# EAGLE board OSSI-1 OBC (EAGLE 6.5.0)
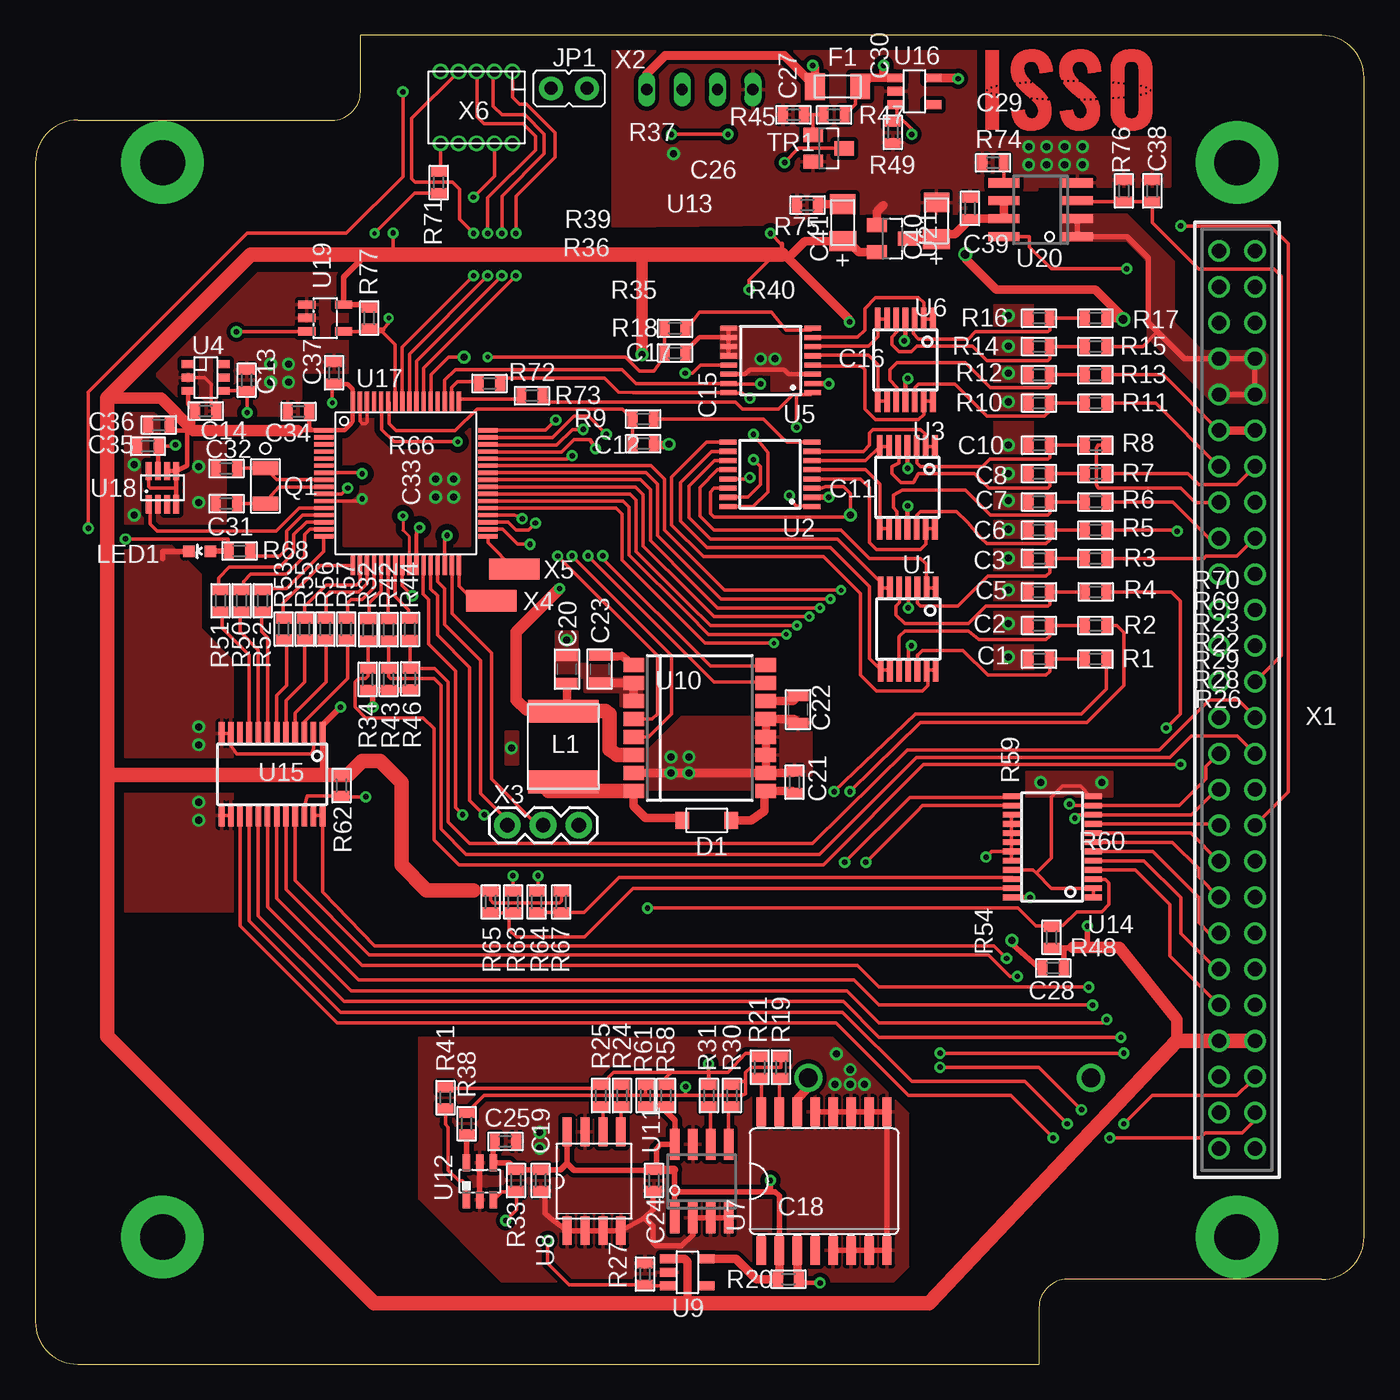
[diagram p4: board, top side]
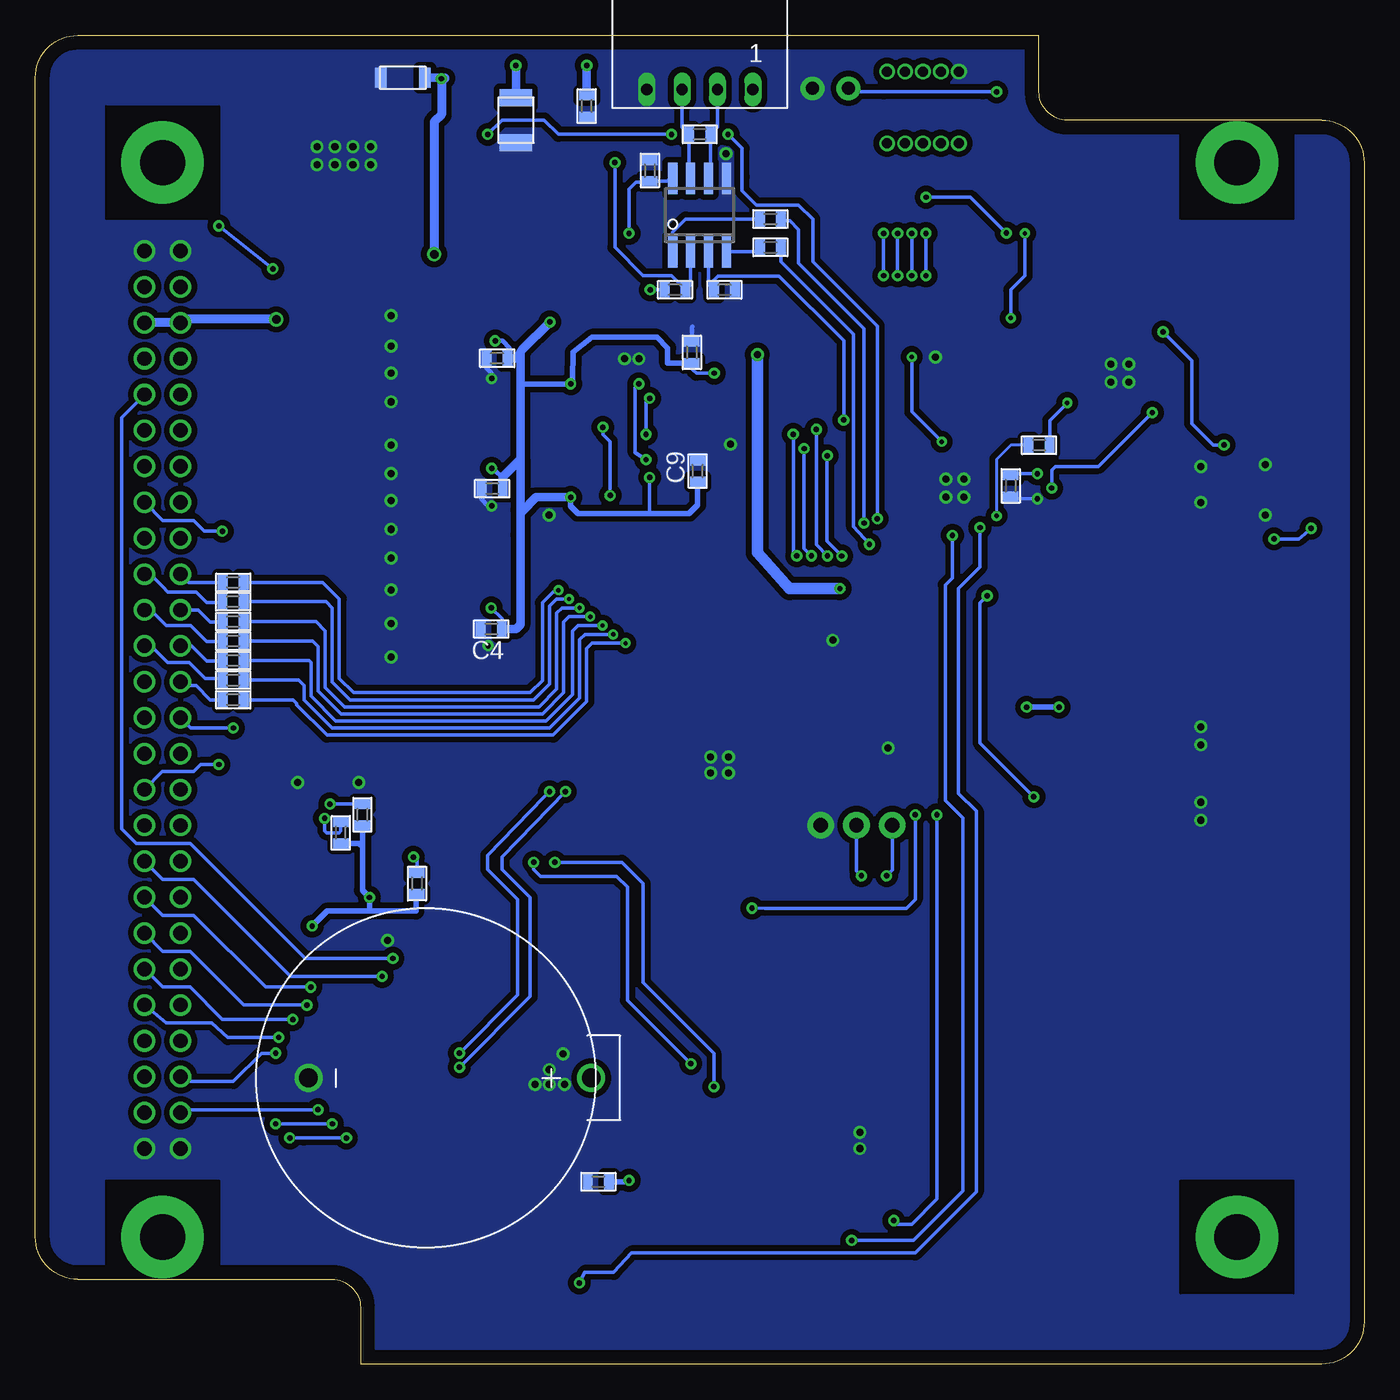
[diagram p5: board, bottom side, seen from below]

Size 94 x 94 mm. Coordinates in mm from the lower left corner, seen from the top.
Outline: 3,88 21,88 arc90 23,90 23,94 91,94 arc-90 94,91 94,9 arc-90 91,6 73,6 arc90 71,4 71,0 3,0 arc-90 0,3 0,85 arc-90 3,88
Copper layers (1*16): Top 0.035mm / dielectric 1.5mm / Bottom 0.035mm
Design rules "default": minimum track width 8mil, minimum drill 10mil, track to track 8mil, track to pad 8mil, pad to pad 4mil, via to via 8mil, smd to smd 2mil, copper to edge 40mil, drill to drill 8mil, minimum pad ring 8mil, minimum via ring 8mil, stop-mask expansion 4mil, vias tented up to drill 0mil, thermal gap 10mil

## Footprints (pad centres in the part's own frame; a part is rotated, then mirrored left to right if it is on the bottom)
BH32T-C-G = drill 1.32: N 0,8.3; P 0,-11.7
C0603(1608) = smd 0.7 x 1.1: 1 -0.75,0; 2 0.75,0
C0805(2012) = smd 0.7 x 1.5: 1 -0.95,0; 2 0.95,0
C1206-GCM31 = smd 0.8 x 1.4: P$1 -1.55,0; P$2 1.55,0
C1210-GCM32 = smd 1.2 x 2.3: P$1 -1.6,0; P$2 1.6,0
C1206(3216)-A = smd 1.4 x 1.9: 1 -1.3,0 | smd 1.4 x 1.8: 2 1.3,0
SOD-123 = smd 0.97 x 1.2: A -1.735,0; C 1.735,0
NANOSMDC150FCT = smd 1.4 x 1.9: 1 -1.6,0 | smd 1.4 x 1.8: 2 1.6,0
3.2-PAD-ROUND = drill 3.2 pad 5.842: B3,2 0,0
JP1 = drill 0.914 pad 1.676: 1 0,-1.27; 2 0,1.27
L(2220) = smd 1.6 x 5: P$1 -2.5,0; P$2 2.5,0
LED-0603 = smd 0.8 x 0.8: A 0,-0.75; C 0,0.75
NX-3215 = smd 1 x 1.8: 1 -1.25,0; 2 1.25,0
R0603(1608) = smd 0.7 x 1.1: 1 -0.75,0; 2 0.75,0
SOT23 = smd 1 x 1.4: 1 -0.95,-1.1; 2 0.95,-1.1; 3 0,1.1
TSSOP14-PW = smd 0.4 x 1.6: 1 -1.95,-2.9; 2 -1.3,-2.9; 3 -0.65,-2.9; 4 0,-2.9; 5 0.65,-2.9; 6 1.3,-2.9; 7 1.95,-2.9; 8 1.95,2.9; 9 1.3,2.9; 10 0.65,2.9; 11 0,2.9; 12 -0.65,2.9; 13 -1.3,2.9; 14 -1.95,2.9
TSSOP16-RU = smd 1.19 x 0.36: 1 -2.97,2.275; 2 -2.97,1.625; 3 -2.97,0.975; 4 -2.97,0.325; 5 -2.97,-0.325; 6 -2.97,-0.975; 7 -2.97,-1.625; 8 -2.97,-2.275; 9 2.97,-2.275; 10 2.97,-1.625; 11 2.97,-0.975; 12 2.97,-0.325; 13 2.97,0.325; 14 2.97,0.975; 15 2.97,1.625; 16 2.97,2.275
TSOT-6UJ-6 = smd 0.55 x 0.9: 1 -0.95,-1.25; 2 0,-1.25; 3 0.95,-1.25; 4 0.95,1.25; 5 0,1.25; 6 -0.95,1.25
SO16L = smd 0.66 x 2.032: 1 -4.445,-4.902; 2 -3.175,-4.902; 3 -1.905,-4.902; 4 -0.635,-4.902; 5 0.635,-4.902; 6 1.905,-4.902; 7 3.175,-4.902; 8 4.445,-4.902; 9 4.445,4.902; 10 3.175,4.902; 11 1.905,4.902; 12 0.635,4.902; 13 -0.635,4.902; 14 -1.905,4.902; 15 -3.175,4.902; 16 -4.445,4.902
SO08-208 = smd 0.66 x 2.032: 1 -1.905,-3.498; 2 -0.635,-3.498; 3 0.635,-3.498; 4 1.905,-3.498; 5 1.905,3.498; 6 0.635,3.498; 7 -0.635,3.498; 8 -1.905,3.498
TSOT23-5 = smd 0.62 x 1.22: P$1 -0.95,-1.31; P$2 0,-1.31; P$3 0.95,-1.31; P$4 0.95,1.31; P$5 -0.95,1.31
SOIC-16CAV = smd 1 x 1.43: 1 -4.445,-4.67; 2 -3.175,-4.67; 3 -1.905,-4.67; 4 -0.635,-4.67; 5 0.635,-4.67; 6 1.905,-4.67; 7 3.175,-4.67; 8 4.445,-4.67; 9 4.445,4.67; 10 3.175,4.67; 11 1.905,4.67; 12 0.635,4.67; 13 -0.635,4.67; 14 -1.905,4.67; 15 -3.175,4.67; 16 -4.445,4.67
SO8 = smd 0.65 x 2.2: 1 -1.905,-2.6; 2 -0.635,-2.6; 3 0.635,-2.6; 4 1.905,-2.6; 5 1.905,2.6; 6 0.635,2.6; 7 -0.635,2.6; 8 -1.905,2.6
SOT23-6DBV = smd 0.55 x 1.2: 1 -0.95,-1.3; 2 0,-1.3; 3 0.95,-1.3; 4 0.95,1.3; 5 0,1.3; 6 -0.95,1.3
TSSOP-24-PW = smd 0.4 x 1.2: 1 -3.575,-2.9; 2 -2.925,-2.9; 3 -2.275,-2.9; 4 -1.625,-2.9; 5 -0.975,-2.9; 6 -0.325,-2.9; 7 0.325,-2.9; 8 0.975,-2.9; 9 1.625,-2.9; 10 2.275,-2.9; 11 2.925,-2.9; 12 3.575,-2.9; 13 3.575,2.9; 14 2.925,2.9; 15 2.275,2.9; 16 1.625,2.9; 17 0.975,2.9; 18 0.325,2.9; 19 -0.325,2.9; 20 -0.975,2.9; 21 -1.625,2.9; 22 -2.275,2.9; 23 -2.925,2.9; 24 -3.575,2.9
PW_R-PDSO-G24 = smd 0.4 x 1.6: 1 -3.575,-2.9; 2 -2.925,-2.9; 3 -2.275,-2.9; 4 -1.625,-2.9; 5 -0.975,-2.9; 6 -0.325,-2.9; 7 0.325,-2.9; 8 0.975,-2.9; 9 1.625,-2.9; 10 2.275,-2.9; 11 2.925,-2.9; 12 3.575,-2.9; 13 3.575,2.9; 14 2.925,2.9; 15 2.275,2.9; 16 1.625,2.9; 17 0.975,2.9; 18 0.325,2.9; 19 -0.325,2.9; 20 -0.975,2.9; 21 -1.625,2.9; 22 -2.275,2.9; 23 -2.925,2.9; 24 -3.575,2.9
PM/PAG64 = smd 1.4 x 0.3: 1 -5.8,3.75; 2 -5.8,3.25; 3 -5.8,2.75; 4 -5.8,2.25; 5 -5.8,1.75; 6 -5.8,1.25; 7 -5.8,0.75; 8 -5.8,0.25; 9 -5.8,-0.25; 10 -5.8,-0.75; 11 -5.8,-1.25; 12 -5.8,-1.75; 13 -5.8,-2.25; 14 -5.8,-2.75; 15 -5.8,-3.25; 16 -5.8,-3.75; 33 5.8,-3.75; 34 5.8,-3.25; 35 5.8,-2.75; 36 5.8,-2.25; 37 5.8,-1.75; 38 5.8,-1.25; 39 5.8,-0.75; 40 5.8,-0.25; 41 5.8,0.25; 42 5.8,0.75; 43 5.8,1.25; 44 5.8,1.75; 45 5.8,2.25; 46 5.8,2.75; 47 5.8,3.25; 48 5.8,3.75 | smd 0.3 x 1.4: 17 -3.75,-5.8; 18 -3.25,-5.8; 19 -2.75,-5.8; 20 -2.25,-5.8; 21 -1.75,-5.8; 22 -1.25,-5.8; 23 -0.75,-5.8; 24 -0.25,-5.8; 25 0.25,-5.8; 26 0.75,-5.8; 27 1.25,-5.8; 28 1.75,-5.8; 29 2.25,-5.8; 30 2.75,-5.8; 31 3.25,-5.8; 32 3.75,-5.8; 49 3.75,5.8; 50 3.25,5.8; 51 2.75,5.8; 52 2.25,5.8; 53 1.75,5.8; 54 1.25,5.8; 55 0.75,5.8; 56 0.25,5.8; 57 -0.25,5.8; 58 -0.75,5.8; 59 -1.25,5.8; 60 -1.75,5.8; 61 -2.25,5.8; 62 -2.75,5.8; 63 -3.25,5.8; 64 -3.75,5.8
SOT23-8 = smd 0.42 x 1.3: 1 -0.975,-1.175; 2 -0.325,-1.175; 3 0.325,-1.175; 4 0.975,-1.175; 5 0.975,1.175; 6 0.325,1.175; 7 -0.325,1.175; 8 -0.975,1.175
SOT23-5DBV = smd 0.6 x 1.22: 1 -0.95,-1.3; 2 0,-1.3; 3 0.95,-1.3; 4 0.95,1.3; 5 -0.95,1.3
ESQ-126-XX-X-D = drill 1.016 pad 1.524: 1 -1.27,31.75; 2 1.27,31.75; 3 -1.27,29.21; 4 1.27,29.21; 5 -1.27,26.67; 6 1.27,26.67; 7 -1.27,24.13; 8 1.27,24.13; 9 -1.27,21.59; 10 1.27,21.59; 11 -1.27,19.05; 12 1.27,19.05; 13 -1.27,16.51; 14 1.27,16.51; 15 -1.27,13.97; 16 1.27,13.97; 17 -1.27,11.43; 18 1.27,11.43; 19 -1.27,8.89; 20 1.27,8.89; 21 -1.27,6.35; 22 1.27,6.35; 23 -1.27,3.81; 24 1.27,3.81; 25 -1.27,1.27; 26 1.27,1.27; 27 -1.27,-1.27; 28 1.27,-1.27; 29 -1.27,-3.81; 30 1.27,-3.81; 31 -1.27,-6.35; 32 1.27,-6.35; 33 -1.27,-8.89; 34 1.27,-8.89; 35 -1.27,-11.43; 36 1.27,-11.43; 37 -1.27,-13.97; 38 1.27,-13.97; 39 -1.27,-16.51; 40 1.27,-16.51; 41 -1.27,-19.05; 42 1.27,-19.05; 43 -1.27,-21.59; 44 1.27,-21.59; 45 -1.27,-24.13; 46 1.27,-24.13; 47 -1.27,-26.67; 48 1.27,-26.67; 49 -1.27,-29.21; 50 1.27,-29.21; 51 -1.27,-31.75; 52 1.27,-31.75
22-05-7045 = drill 0.8 long: 1 -3.75,0; 2 -1.25,0; 3 1.25,0; 4 3.75,0
1X03 = drill 1.016 pad 1.88: 1 0,0; 2 2.54,0; 3 5.08,0
P-PAD-S = smd 3.556 x 1.5: 1 0,0
M50-3200545 = drill 0.7 pad 1: 1 -2.54,-2.54; 2 -2.54,2.54; 3 -1.27,-2.54; 4 -1.27,2.54; 5 0,-2.54; 6 0,2.54; 7 1.27,-2.54; 8 1.27,2.54; 9 2.54,-2.54; 10 2.54,2.54

## Placement (x,y rotation side)
BAT1  BATTERY-BH32T  [BH32T-C-G]  66.38,20.25 90 bottom
C1  100nF  [C0603(1608)]  71,49.88 180 top
C2  100nF  [C0603(1608)]  71,52.25 180 top
C3  100nF  [C0603(1608)]  71,57 180 top
C4  100nF  [C0603(1608)]  61.75,52 180 bottom
C5  100nF  [C0603(1608)]  71,54.62 180 top
C6  100nF  [C0603(1608)]  71,59 180 top
C7  100nF  [C0603(1608)]  71,61 180 top
C8  100nF  [C0603(1608)]  71,63 180 top
C9  100nF  [C0603(1608)]  47.16,63.18 90 bottom
C10  100nF  [C0603(1608)]  71,65 180 top
C11  100nF  [C0603(1608)]  61.68,61.94 180 bottom
C12  100nF  [C0603(1608)]  43,65.11 0 top
C13  100nF  [C0603(1608)]  14.95,69.6 270 top
C14  100nF  [C0603(1608)]  12.05,67.43 180 top
C15  100nF  [C0603(1608)]  47.55,71.57 90 bottom
C16  100nF  [C0603(1608)]  61.33,71.16 180 bottom
C17  100nF  [C0603(1608)]  45.25,71.52 0 top
C18  100nF  [C0603(1608)]  54.17,12.9 180 bottom
C19  100nF  [C0603(1608)]  35.75,13 270 top
C20  1uF 0805  [C0805(2012)]  37.6,49.15 90 top
C21  100nF  [C0603(1608)]  53.7,41.18 270 top
C22  1uF 0805  [C0805(2012)]  53.95,46.3 270 top
C23  1uF 0805  [C0805(2012)]  39.92,49.18 270 top
C24  100nF  [C0603(1608)]  43.75,13 270 top
C25  100nF  [C0603(1608)]  33.26,15.75 0 top
C26  100nF  [C0603(1608)]  50.52,84.43 90 bottom
C27  100nF  [C0603(1608)]  55,89 270 bottom
C28  100nF  [C0603(1608)]  72,28.02 180 top
C29  4.7uF, 1210  [C1206-GCM31]  68,91 180 bottom
C30  10uF,3225  [C1210-GCM32]  60,88 270 bottom
C31  12.5pF  [C0603(1608)]  13.52,60.87 180 top
C32  12.5pF  [C0603(1608)]  13.52,63.37 180 top
C33  100nF  [C0603(1608)]  25,62.13 270 bottom
C34  100nF  [C0603(1608)]  18.61,67.39 180 top
C35  100nF  [C0603(1608)]  7.96,64.94 180 top
C36  100nF  [C0603(1608)]  8.73,66.43 180 top
C37  100nF  [C0603(1608)]  21.13,70.13 90 top
C38  1uF  [C0603(1608)]  79,83 90 top
C39  100nF  [C0603(1608)]  66.12,81.76 90 top
C40  10uF, LDO Tantal 16V  [C1206(3216)-A]  63.75,80.88 90 top
C41  10uF, LDO Tantal 16V  [C1206(3216)-A]  57.12,80.75 90 top
D1  MMSD4148T1G  [SOD-123]  47.5,38.46 0 top
F1  POLYSWITCH  [NANOSMDC150FCT]  56.75,90.38 0 top
H1  MOUNT-PAD-ROUND3.2  [3.2-PAD-ROUND]  85,85 0 top
H2  MOUNT-PAD-ROUND3.2  [3.2-PAD-ROUND]  85,9 0 top
H3  MOUNT-PAD-ROUND3.2  [3.2-PAD-ROUND]  9,9 0 top
H4  MOUNT-PAD-ROUND3.2  [3.2-PAD-ROUND]  9,85 0 top
JP1  [JP1]  37.75,90.25 90 top
L1  470uH, 240mA  [L(2220)]  37.35,43.69 270 top
LED1  [LED-0603]  11.62,57.5 90 top
Q1  NX-3215  [NX-3215]  16.27,62.13 270 top
R1  10k  [R0603(1608)]  75,49.88 0 top
R2  10k  [R0603(1608)]  75,52.25 0 top
R3  10k  [R0603(1608)]  75,57 0 top
R4  10k  [R0603(1608)]  75.01,54.63 0 top
R5  10k  [R0603(1608)]  75,59 0 top
R6  10k  [R0603(1608)]  75,61 0 top
R7  10k  [R0603(1608)]  75,63 0 top
R8  10k  [R0603(1608)]  75,65 0 top
R9  10k  [R0603(1608)]  43,66.86 0 top
R10  100k  [R0603(1608)]  71,67.98 0 top
R11  100k  [R0603(1608)]  75,67.98 0 top
R12  100k  [R0603(1608)]  71,69.98 0 top
R13  100k  [R0603(1608)]  75,69.98 0 top
R14  100k  [R0603(1608)]  71,71.98 0 top
R15  100k  [R0603(1608)]  75,71.98 0 top
R16  100k  [R0603(1608)]  71,73.98 0 top
R17  100k  [R0603(1608)]  75,73.98 0 top
R18  10k  [R0603(1608)]  45.25,73.27 0 top
R19  250  [R0603(1608)]  52.74,21 270 top
R20  470k  [R0603(1608)]  53.27,6.02 180 top
R21  250  [R0603(1608)]  51.24,21 270 top
R22  1.5k  [R0603(1608)]  80,51.14 0 bottom
R23  1.5k  [R0603(1608)]  80,52.52 0 bottom
R24  250  [R0603(1608)]  41.49,19 270 top
R25  250  [R0603(1608)]  40,19 270 top
R26  1.5k  [R0603(1608)]  80,47 0 bottom
R27  100k  [R0603(1608)]  43.12,6.38 90 top
R28  1.5k  [R0603(1608)]  80,48.38 0 bottom
R29  1.5k  [R0603(1608)]  80,49.76 0 bottom
R30  250  [R0603(1608)]  49.27,19 270 top
R31  250  [R0603(1608)]  47.65,19 270 top
R32  4.7k  [R0603(1608)]  23.54,51.96 90 top
R33  470k  [R0603(1608)]  34,13 270 top
R34  470k  [R0603(1608)]  23.51,48.45 270 top
R35  33k  [R0603(1608)]  45.25,76 180 bottom
R36  4.7k  [R0603(1608)]  42,79 180 bottom
R37  120, DNP  [R0603(1608)]  47,87 0 bottom
R38  250  [R0603(1608)]  30.51,17.01 270 top
R39  4.7k  [R0603(1608)]  42,81 180 bottom
R40  33k  [R0603(1608)]  48.75,76 180 bottom
R41  250  [R0603(1608)]  29.01,18.84 270 top
R42  4.7k  [R0603(1608)]  25,51.96 90 top
R43  470k  [R0603(1608)]  25,48.45 270 top
R44  4.7k  [R0603(1608)]  26.49,51.98 90 top
R45  100k  [R0603(1608)]  53.62,88.38 180 top
R46  470k  [R0603(1608)]  26.53,48.47 270 top
R47  100k  [R0603(1608)]  56.5,88.38 180 top
R48  100k  [R0603(1608)]  71.89,30.19 270 top
R49  100k  [R0603(1608)]  60.66,87.14 270 top
R50  1.5k  [R0603(1608)]  13.1,54 90 top
R51  1.5k  [R0603(1608)]  14.59,54 90 top
R52  1.5k  [R0603(1608)]  16.08,54 90 top
R53  1.5k  [R0603(1608)]  17.57,52 90 top
R54  10k  [R0603(1608)]  67,34 270 bottom
R55  1.5k  [R0603(1608)]  19.06,52 90 top
R56  1.5k  [R0603(1608)]  20.51,52 90 top
R57  1.5k  [R0603(1608)]  22,52 90 top
R58  10k  [R0603(1608)]  44.62,19 270 top
R59  10k  [R0603(1608)]  70.87,38.86 270 bottom
R60  10k  [R0603(1608)]  72.39,37.59 270 bottom
R61  10k  [R0603(1608)]  43.17,19 270 top
R62  100k  [R0603(1608)]  21.66,40.93 90 top
R63  250  [R0603(1608)]  33.8,32.7 90 top
R64  250  [R0603(1608)]  35.47,32.7 90 top
R65  10k  [R0603(1608)]  32.2,32.7 90 top
R66  300k  [R0603(1608)]  23,65 180 bottom
R67  10k  [R0603(1608)]  37.2,32.7 90 top
R68  4.7k  [R0603(1608)]  14.45,57.52 0 top
R69  4.7k  [R0603(1608)]  80.02,53.94 0 bottom
R70  4.7k  [R0603(1608)]  80,55.3 0 bottom
R71  4.7k  [R0603(1608)]  28.54,83.59 270 top
R72  0  [R0603(1608)]  32.12,69.38 0 top
R73  0  [R0603(1608)]  35.12,68.5 0 top
R74  6.2k  [R0603(1608)]  67.75,84.98 0 top
R75  0  [R0603(1608)]  54.62,82 180 top
R76  100k  [R0603(1608)]  77,83 270 top
R77  100k  [R0603(1608)]  23.62,74 90 top
TR1  FDV301N  [SOT23]  56.12,86 270 top
U1  OPA4347  [TSSOP14-PW]  61.75,52 180 top
U2  ADG708  [TSSOP16-RU]  51.96,62.95 180 top
U3  OPA4347  [TSSOP14-PW]  61.69,62.02 180 top
U4  ADR121  [TSOT-6UJ-6]  12.06,69.8 270 top
U5  ADG708  [TSSOP16-RU]  52.02,71 180 top
U6  OPA4347  [TSSOP14-PW]  61.55,71.04 180 top
U7  DS3231-L  [SO16L]  55.8,12.94 0 top
U8  24LC256-8LEAD  [SO08-208]  39.52,12.94 0 top
U9  LTC4411  [TSOT23-5]  46.12,6.5 270 top
U10  ADXRS450SOIC  [SOIC-16CAV]  47,45 270 top
U11  FM24V02-G  [SO8]  47.14,12.94 0 top
U12  TMP101  [SOT23-6DBV]  31.44,12.94 0 top
U13  SN65HVD11QD  [SO8]  47.01,81.28 0 bottom
U14  TCA9548APWR  [TSSOP-24-PW]  71.93,36.59 90 top
U15  SN74LVC8T245PWR  [PW_R-PDSO-G24]  16.75,41.72 180 top
U16  LTC4411  [TSOT23-5]  62.19,90.04 270 top
U17  MSP430F1611  [PM/PAG64]  26.21,62.31 0 top
U18  MAX6369  [SOT23-8]  9,62 0 top
U19  TPS3838  [SOT23-5DBV]  20.51,74 270 top
U20  MAX890L  [SO8]  71.12,81.66 90 top
U21  MCP1700_SOT23  [SOT23]  60.62,79.62 270 top
U$1  OSSILOGORECT  [OSSILOGORECT1005]  79,93 180 top
X1  ESQ-126-38-G-D  [ESQ-126-XX-X-D]  85,47 0 top
X2  MOLEX-22-05-7045  [22-05-7045]  47,90.17 180 bottom
X3  [1X03]  33.38,38.12 0 top
X4  P-PAD-S  [P-PAD-S]  32.25,54 180 top
X5  P-PAD-S  [P-PAD-S]  33.88,56.25 180 top
X6  JTAG10PINMINI-H  [M50-3200545]  31.21,88.9 180 top

## Tracks (layer width: path | path; a pad name or v marks a point on that pad's centre or on a via)
3.3VOBC  (via drill 0.31, 0.38, 0.5)
  Top 0.254: R65.2 32.2,32.82 32.38,32.64 37.08,32.64 37.21,32.77 37.21,33.44 R67.2 | U18.8 8.03,62.08 8.13,61.98 9.97,61.98 | X6.4 32.48,84.04 v30.99,82.55 | v25.31,80.02 25.31,78.61 27.43,78.49 | 27.69,78.49 23.38,78.49 | U5.13 47.05,70.67 46.48,70.1 v45.97,70.1 | U2.13 50.19,62.62 v50.55,62.72 | v21,68 21,69 21,69.25 C37.1 | 52.83,79.26 52.83,79.17 v52,80 | v50.5,76 50.5,76.67 52.83,79 | U1.4 v61.75,53.5
  Top 0.305: 19.56,66.06 U17.1 21.86,66.06 22.35,66.55 22.46,66.69 U17.64 22.46,68.98 22.1,69.34 21.16,69.34 C37.1 | 19.56,66.06 18.56,66.06 18.54,66.04 | C34.1 19.36,66.25 19.56,66.06 | 10.92,66.04 11.18,66.04 11.18,67.3 C14.2 10.81,67.92 U4.3 | 10.92,66.04 9.88,66.04 C36.1 | U18.5 10.74,63.57 10.74,65.86 10.92,66.04 | U18.5 U18.6 | U18.4 9.97,61.98 U18.5 | 52.83,79.26 52.83,79.17 52.83,79 52.83,78.74 52.83,78.49 | U6.4 61.55,72.72 v61.47,72.39 | U3.4 61.69,63.53 v61.72,63.37
  Top 0.406: X1.45 | R65.2 31.07,33.45 30.99,33.53 | 54.86,4.58 55.12,4.32 | R62.2 21.36,41.68 21.34,41.66 20.57,41.66 20.33,41.9 U15.1 20.33,45.22 v21.59,46.48 | v23.88,46.48 23.88,47.33 R34.2 R43.2 26.5,47.7 R46.2 | R48.2 72.9,29.44 | 72.9,29.44 73.38,29.44 73.41,29.46 | C28.1 72.75,29.3 72.9,29.44 | v74.42,30.99 74.42,29.46 | U14.24 v70.35,33.02 v70.36,33.02 | 23.38,78.49 21.81,76.91 U19.5 23.42,74.95 R77.2 | U5.2 56.1,69.38 v56.13,69.34 | U2.2 v56.13,61.32 v56.13,61.33
  Top 0.61: C20.1 37.6,46.25 37.08,46.26 38.28,46.26 L1.P$1 | 5.36,41.68 5.33,41.66 5.08,41.66 | v57.6,73.72 57.6,73.9 53.25,78.25 | 53.25,78.25 52.88,78.62 | 52.88,78.62 52.75,78.75 | 52.83,78.74 52.83,78.67 52.88,78.62 | 17.27,11 17.14,11.14 | U9.P$1 45.92,7.45 46.12,7.25 46.12,4.32 | 46.12,4.32 46.12,4.25 46.12,4.32 | 53.25,78.25 54.45,79.45 C41.1 57.48,79.45 58.26,78.67 U21.2
  Top 0.813: U10.6 | 80.76,22.86 80.76,24.38 76.68,29.46 74.42,29.46 73.41,29.46 | 5.08,68.33 8.89,68.33 11.18,66.04 18.54,66.04 | 37.6,46.25 37.85,46.25 35.05,46.26 34.74,46.26 34,47 34,51.78 v37.08,54.86 | v42.93,71.41 42.93,78.49
  Top 1.016: 52.83,78.49 42.93,78.49 27.69,78.49 27.43,78.49 23.38,78.49 15.24,78.49 5.08,68.33 5.08,41.66 5.08,23.19 17.14,11.14 23.96,4.32 46.12,4.32 55.12,4.32 63.21,4.32 80.76,22.86 X1.45 | X1.45 X1.46 | L1.P$1 40.33,46.19 40.63,46.01 40.63,43.47 41.14,43.09 U10.6 | 5.36,41.68 R62.2 22.12,41.68 23.11,42.67 24.38,42.67 25.91,41.15 25.91,35.31 27.69,33.53 30.99,33.53
  Bottom 0.254: v30.99,82.55 27.84,82.55 v25.31,80.02 | v45.97,70.1 47.24,70.1 47.5,70.36 47.5,70.87 C15.1 | v50.55,62.72 50.55,60.18 | R66.1 22.25,66.75 v21,68 | U13.8 48.91,83.92 49,84 49.32,83.68 C26.1 50.5,83.66 50.5,83.62 51.5,83.62 52,83.12 v52,80 | R40.2 v50.5,76 | v61.75,53.5 61,52.75 C4.1
  Bottom 0.305: v61.47,72.39 60.96,72.39 60.45,71.88 60.45,71.12 60.49,71.16 C16.1 | v61.72,63.37 60.96,62.74 59.69,64.01
  Bottom 0.406: v21.59,46.48 v23.88,46.48 | 70.36,32.04 67.08,32.04 67.08,33.17 R54.2 | 70.36,32.04 73.37,32.04 v74.42,30.99 | 70.36,32.04 70.36,32.3 v70.36,33.02 70.87,33.53 70.87,36.58 | R59.2 70.87,36.58 | R60.2 71.13,36.84 70.87,36.58 | 59.69,69.34 v56.13,69.34 56.1,69.38 56.01,69.63 55.95,71.59 54.61,72.64 50.04,72.64 49.28,71.88 49.28,70.82 C15.1 | 59.56,60.33 59.69,60.45 | v56.13,61.33 56.13,60.69 55.63,60.18 50.55,60.18 47.75,60.18 47.16,60.78 C9.1
  Bottom 0.61: C16.1 59.94,71.11 | 59.94,71.11 59.57,71.75 v57.6,73.72 | C11.1 60.93,62.77 59.69,64.01 | 59.69,64.01 59.69,69.34 59.69,71.5 59.94,71.11 | 59.69,64.01 59.69,60.45 59.69,58.67 59.69,52.31 60,52 C4.1 | 59.56,60.33 58.56,61.33 v56.13,61.33
  Bottom 0.813: v37.08,54.86 40.64,54.86 42.93,57.4 v42.93,71.41
3.3VOBC_I2C  (via drill 0.38)
  Top 0.203: 45.21,10.41 U11.1 | C24.1 43.81,13.84 43.72,13.72 | R33.1 34.04,13.84 34.04,13.75
  Top 0.406: C25.1 32.39,15.63 U12.4 33.51,14.24 R33.1 34.04,13.75 C19.1 37.16,13.75 37.62,14.2 | C24.1 43.94,13.94 43.94,15.24 44.24,15.54 U11.8 45.25,15.55 45.25,17.25 44.62,17.88 R58.2 R61.2 | U8.8 37.62,14.2 | 37.62,14.2 38.1,13.72 43.72,13.72 | U7.2 52.62,11.9 52.33,12.19 52.06,12.19 | 52.06,12.19 45.47,12.19 45.21,11.94 | 45.21,11.94 45.21,10.41 45.21,10.36 | 45.18,13.75 45.21,13.72 45.21,11.94 | v52,13 52,12.25 52.06,12.19
  Top 0.61: U7.2 52.62,6.12 R20.2 52.51,6 51,6 49.55,7.45 U9.P$5 | 45.18,13.75 C24.1
  Bottom 0.406: C18.1 52.1,12.9 v52,13
/RE  (via drill 0.38)
  Top 0.254: TR1.3 54,86 v53,85
  Bottom 0.254: U13.2 47.65,76.36 R40.1 49,77 51,77 53,79 v53,85
A
  Bottom 0.254: 46,89.92 X2.2 45.75,87.5 R37.2 46.25,84 U13.6
ADC0
  Top 0.254: U17.59 25.02,68.05 25.02,66.53 25.53,66.02 29.7,66.02 31.24,67.56 39.88,67.56 41.55,67.56 R9.1 C12.1
ADC1  (via drill 0.31)
  Top 0.254: U17.60 24.51,68.16 24.5,68.15 24.5,66.12 25.38,65.25 v29.88,65.25 | R18.1 C17.1 44.5,71.5 44.62,71.5 43.75,70.25 42.75,70.25 41.75,71.25 40,71.25 v32,71.25
  Bottom 0.254: v29.88,65.25 32,67.38 v32,71.25
ANT_DEPLOY1
  Bottom 0.254: R70.1 83.14,55.3 X1.19
ANT_DEPLOY2
  Bottom 0.254: X1.20 85.89,55.89 85,55 84.62,54.62 82.62,54.62 81.88,53.88 80.83,53.88 R69.1
B
  Bottom 0.254: 48,89.92 X2.3 48.25,87.5 R37.1 47.75,83.98 U13.7
BAT_-CHRG  (via drill 0.38)
  Top 0.254: U15.18 16.43,32.34 22.35,26.42 57.4,26.42 59.69,24.13 75.53,24.13 v75.79,24.38
  Bottom 0.254: v75.79,24.38 80.77,24.38 83.06,26.67 84.99,26.67 X1.42
BAT_-CHRG_IN
  Top 0.254: U17.17 20.19,56.51 17.53,53.85 17.53,52.8 R53.2
BAT_-FAULT  (via drill 0.38)
  Top 0.254: U15.17 15.78,31.72 21.84,25.65 57.15,25.65 59.69,23.11 v76.79,23.11
  Bottom 0.254: v76.79,23.11 80.39,23.11 81.53,24.13 84.74,24.13 X1.44
BAT_-FAULT_IN
  Top 0.254: U17.16 20.41,57.49 17.78,54.86 16.19,54.86 R52.2
BAT_-ON  (via drill 0.38)
  Top 0.254: U15.20 17.73,33.58 23.11,28.19 58.17,28.19 59.69,26.67 v74.52,26.67
  Bottom 0.254: v74.52,26.67 77.72,26.67 82.8,31.75 84.99,31.75 X1.38
BAT_-ON_IN
  Top 0.254: U17.19 23.46,55.21 22.86,54.61 20.83,54.61 20.57,54.36 20.57,52.82 R56.2
BAT_TEMP  (via drill 0.38)
  Top 0.254: R2.2 76.5,52.25 77,51.75 77,48 74.38,45.38 62.62,45.38 v57.62,40.5 | v64,22 v77,22
  Bottom 0.254: v57.62,40.5 58,40.12 62,36 62,35 59.88,32.88 59.88,26.12 v64,22 | v77,22 78,22 80,20 83.4,20 X1.47
BEACON_-FAULT
  Top 0.254: R42.1 R43.1 25,48.66 25.15,48.51 28.19,48.51 28.7,48.01 28.7,37.85 30.48,36.07 55.48,36.07 62.32,42.93 80.26,42.93 81.79,44.45 85.01,44.45 X1.30
BEACON_-FAULT_IN
  Top 0.254: U17.22 24.96,52.74 R42.2
BEACON_OFF
  Bottom 0.254: X1.24 85.81,50.81 84.62,49.62 83.12,49.62 82,48.5 80.87,48.5 R28.1
BEACON_OFF_OUT  (via drill 0.3)
  Top 0.254: U17.38 41.44,61.06 41.56,61.06 42,60.62 42,57.25 46.12,53.12 47.62,51.62 v53.12,51.62
  Bottom 0.254: v53.12,51.62 55.12,51.62 55.5,51.25 55.5,47.12 57.62,45 73,45 75,47 75,48 75.38,48.38 R28.2
BEACON_SCL
  Top 0.254: U14.7 80.43,36.91 82.3,35.05 82.3,34.46 X1.37
BEACON_SDA
  Top 0.254: U14.6 79.05,36.27 82.3,33.02 82.3,31.24 83.06,30.48 X1.39
BUS_CS  (via drill 0.38)
  Top 0.254: R4.2 80.37,54.63 81,54 81,46 v80,45
  Bottom 0.254: v80,45 83,45 X1.27 | X1.27 84,46 X1.27
COMMS_-FAULT  (via drill 0.38)
  Top 0.254: R32.1 23.54,49.23 | 23.54,49.23 R34.1 | 23.54,49.23 23.54,48.69 23.37,48.51 22.86,48.51 22.61,48.26 22.61,46.48 23.37,45.72 27.43,45.72 28.19,44.96 28.19,37.08 29.97,35.31 55.74,35.31 62.83,42.42 v81.03,42.42
  Bottom 0.254: v81.03,42.42 82.3,42.42 82.8,41.91 85.01,41.91 X1.32
COMMS_-FAULT_IN
  Top 0.254: U17.21 24.46,54.69 23.62,53.85 23.62,52.79 R32.2
COMMS_OFF
  Bottom 0.254: R26.1 81.62,47 82.62,48 83.46,48 X1.25
COMMS_OFF_OUT  (via drill 0.3)
  Top 0.254: U17.37 41.06,60.56 41.5,60.12 41.5,56.88 45.88,52.5 47.38,51 v52.25,51
  Bottom 0.254: v52.25,51 54.62,51 55,50.62 55,46.88 57.38,44.5 73.38,44.5 75.5,46.62 75.5,46.75 75.75,47 R26.2
COMMS_SCL
  Top 0.254: U14.5 78.43,35.62 81.03,33.02 81.03,30.48 83.57,27.94 83.82,27.94 83.81,27.95 X1.41
COMMS_SDA
  Top 0.254: U14.4 77.81,34.97 80.26,32.51 80.26,28.88 X1.43
DE  (via drill 0.38)
  Top 0.254: U17.48 36.08,66.06 v36.81,66.79
  Bottom 0.254: U13.3 46.38,76.38 R35.2 46,75.92 46.23,75.69 46.23,76.45 45.72,76.96 41.39,76.96 36.81,72.39 v36.81,66.79
GND  (via drill 0.38, 0.5)
  Top 0.254: U17.11 22.96,61.06 v23.11,61.21 | U15.14 U15.13 | U15.12 U15.11 13.72,44.51 13.72,43.94 14.22,43.18 19.56,43.18 19.68,43.55 U15.2 | U14.21 70.57,34.97 70.8,34.73 | 70.8,34.73 71.88,33.66 74.82,33.66 U14.2 U14.1 | U14.12 74.64,40.16 73.91,40.89 72.64,40.89 71.88,40.13 71.88,35.81 70.8,34.73 | U17.63 22.96,66.7 23.11,66.55 23.37,66.55 23.46,66.64 U17.62 | U4.2 11.99,69.8 12.45,69.34 12.45,67.78 C14.1 | U2.3 55.64,61.97 55.88,62.09 57.15,62.09 57.66,61.58 v57.66,60.05 | 57.66,59.93 v57.66,60.05 | U2.14 48.02,61.97 47.75,61.71 47.75,60.18 48.01,59.93 57.53,59.93 v57.66,60.05 | 60.77,90.15 U16.P$2 | U1.11 61.75,50.62 61.85,50.78 v61.97,50.83 | U17.53 28,68.15 28,70 29,71 29.23,71.23 v30.33,71.23
  Top 0.305: U6.11 61.55,69.42 v61.72,69.72 | U3.11 61.69,60.67 v61.72,60.71 | U5.9 U5.10 | U5.10 U5.11 49.05,71.4 49.02,71.37 49.05,71.35 U5.12 | C17.2 46,71.66 46.99,72.64 49.03,72.64 U5.10 | U5.14 50.21,70.03 50.55,70.36 52.96,70.36 53.29,70.03 U5.3 | 50.82,90.15 50.8,90.17 X2.4
  Top 0.406: U12.2 U12.5 | U11.4 U11.3 U11.2 46.51,9.17 45.72,8.38 43.94,8.38 43.69,8.64 43.69,9.76 43.11,10.34 | C28.2 71.25,27.8 69.09,29.72 v69.09,29.97 | U7.13 U7.12 U7.11 U7.10 U7.9 U7.8 U7.7 U7.6 U7.5 | 43.11,10.34 U8.4 U8.3 U8.2 U8.1 36.4,10.34 36.07,10.67 36.07,12.19 C19.2 | 43.11,10.34 43.69,10.92 43.69,12.19 C24.2 | LED1.C 9,57.5 9,57
  Top 0.61: U10.10 53.6,41.83 C21.1 | C23.2 40.13,48.17 U10.2 U10.3 | U10.10 U10.11 U10.12 U10.13 53.67,45.63 C22.2 | U10.10 U10.7 | C12.2 43.87,65 45,65 44.93,65.07 v44.83,65.07 | C40.2 63.83,82.17 64,82 63.5,82 63.34,81.84 | U21.1 59.52,81.53 60,82
  Bottom 0.254: v23.11,61.21 24.84,61.21 C33.2
  Bottom 0.305: v61.72,69.72 61.72,70.1 62.1,70.48 62.1,71.14 C16.2 | v61.72,60.71 61.98,60.71 62.48,61.21 62.48,61.98 62.47,61.98 C11.2 | C15.2 47.55,73.35 47.5,73.41 | C9.2 47.18,63.93 47.5,64.25
  other vias: 44.96,42.96 37.59,51.21 46.23,42.96 44.96,41.81 46.23,41.81 68.83,68.07 68.83,65.02 68.83,70.1 68.83,72.01 68.83,74.17 68.83,62.99 68.83,61.09 68.83,59.05 68.83,57.02 51.31,71.12 52.32,71.12 71.12,41.15 75.44,41.15 57.64,20.84 58.66,19.79 56.67,21.95 56.56,19.79 35.68,15.25 35.68,16.39 33.67,43.59 11.56,63.5 11.56,60.96 6.99,60.07 6.99,63.63 16.64,70.74 17.91,70.74 16.64,69.47 17.91,69.47 28.32,61.34 29.59,62.61 29.59,61.34 28.32,62.61 11.56,45.09 11.56,43.81 11.56,39.75 11.56,38.48 70.27,86.13 71.54,86.13 72.81,86.13 70.27,84.86 71.54,84.86 72.81,84.86 74.08,86.13 74.08,84.86 57.64,19.79 45.14,85.63 68.83,54.77 68.83,52.4 68.83,50.02
  pour Bottom (isolate 0.406, no thermals): 23,94 23,88 0,88 0,87 0,0 71,0 71,6 94,6 94,94
  pour Top (isolate 0.254): 54.86,45.75 45.72,45.75 43.43,43.47 43.43,40.67 50.55,40.67 50.55,41.69 54.86,41.69
  pour Top (isolate 0.254, no thermals): 36.83,51.85 38.35,51.85 38.35,49.56 40.64,49.56 40.64,48.55 42.93,48.55 42.93,46.51 41.4,46.51 41.4,47.53 38.86,47.53 38.86,48.55 36.83,48.55
  pour Top (no thermals): 70.61,49.13 70.61,74.93 67.82,74.93 67.82,49.13
  pour Top (no thermals): 48.51,73.41 52.32,73.41 52.83,72.9 54.1,72.9 54.1,70.1 55.5,70.1 55.5,69.98 54.1,69.98 54.1,68.83 52.07,68.83 52.07,69.98 48.51,69.98 48.51,70.1 50.04,70.1 50.04,71.12 48.51,71.12
  pour Top (no thermals): 75.44,40.13 70.1,40.13 70.1,41.91 76.2,41.91 76.2,40.13
  pour Top (isolate 0.305): 27.13,23.11 56.39,23.11 61.72,17.78 61.72,6.86 60.71,5.84 32.97,5.84 27.13,11.68
  pour Top (no thermals): 33.29,44.74 33.29,42.45 34.12,42.45 34.12,44.74
  pour Top (isolate 0.305, no thermals): 6.35,59.44 6.35,67.31 8.38,67.31 10.67,65.28 13.46,65.28 13.46,59.44
  pour Top (isolate 0.305): 8.64,70.1 15.75,77.22 22.1,77.22 22.1,70.1 18.8,70.1 18.8,67.06 11.43,67.06 8.64,69.85
  pour Top (isolate 0.406, no thermals): 21.84,66.8 30.73,66.8 30.73,57.91 21.84,57.91
  pour Top (isolate 0.305): 13.97,42.93 6.35,42.93 6.35,58.42 9.14,58.42 11.68,55.88 11.68,52.07 13.97,49.78
  pour Top (isolate 0.305): 6.35,40.39 13.97,40.39 13.97,32 6.35,32
  pour Top (isolate 0.305): 55.2,81.43 65.79,81.43 65.79,83.09 70.87,83.09 70.87,83.33 80.26,83.33 80.26,86.75 66.5,86.75 66.5,93 40.86,93 40.86,80.51 53.07,80.64 53.62,80.62
GYRO_-CS  (via drill 0.38)
  Top 0.254: U17.44 32.06,64.01 37.59,64.01 v37.98,64.26 | v36.95,57.17 44,50.12 44,46 43.63,45.63 U10.4
  Bottom 0.254: v36.95,57.17 38,58.22 38,64 38.1,64.1 v37.98,64.26
GYRO_SCLK  (via drill 0.38)
  Top 0.254: U17.47 32.04,65.53 36.58,65.53 38.1,67.06 39.12,67.06 v40.39,65.79 | U10.16 51.6,49.38 47.75,49.38 40.14,56.99 v40.14,57.19
  Bottom 0.254: v40.14,57.19 40.39,57.44 v40.39,65.79
GYRO_SI  (via drill 0.38)
  Top 0.254: U17.45 32.05,64.52 37.21,64.52 38.1,65.4 39.24,65.4 v39.62,64.77 | U10.15 51.3,48.17 51.09,48.25 48,48.25 47.5,48.75 39.1,57.15 v39.1,57.19
  Bottom 0.254: v39.1,57.19 39.62,57.71 v39.62,64.77
GYRO_SO  (via drill 0.38)
  Top 0.254: U17.46 32.07,65 36.88,65 38,66.12 38.38,66.12 v38.75,66.12 | v37.96,57.18 45,50.14 45,46 43.37,44.37 U10.5
  Bottom 0.254: v37.96,57.18 38.75,57.96 v38.75,66.12
I2C_-RST  (via drill 0.38)
  Top 0.254: U17.28 27.96,54.84 28.45,54.36 28.45,51.56 30.73,49.28 30.73,39.88 v31.75,38.86 | 71.63,30.99 71.88,31.03 | 71.88,31.03 R48.1 71.84,30.99 70.77,30.99 69.5,32.26 v43.31,32.26 | 71.88,31.03 72.69,31.03 73.66,32 75.44,32 75.95,32.51 75.95,34.04 75.69,34.29 74.93,34.29 74.91,34.31 U14.3
  Bottom 0.254: v31.75,38.86 31.75,32.88 32.38,32.25 40.88,32.25 42.38,32.25 43.37,32.26 v43.31,32.26
I2C_SCL
  Top 0.254: U14.22 69.13,34.42 41.27,34.42 38.81,31.95 R67.1 R64.1
I2C_SCL_TP  (via drill 0.38)
  Top 0.254: U17.31 29.46,53.09 32.26,50.29 32.26,41.4 35.53,38.12 X3.2 | v35.56,34.54 35.56,33.29 R64.2
  Bottom 0.254: X3.2 35.91,34.9 v35.56,34.54
I2C_SDA
  Top 0.254: 33.53,31.93 33.53,30.99 33.53,30.73 34.04,30.23 38.85,30.23 42.28,33.66 43.21,33.66 U14.23 | 33.53,31.93 R63.1 | 33.53,31.93 32.47,31.93 R65.1
I2C_SDA_TP  (via drill 0.38)
  Top 0.254: U17.29 28.45,56.5 28.45,55.37 28.96,54.86 28.96,52.32 31.5,49.78 31.5,40.39 33.38,38.51 X3.1 | v33.78,34.54 33.78,33.21 R63.2
  Bottom 0.254: X3.1 33.38,34.95 v33.78,34.54
IO_-OE  (via drill 0.38)
  Top 0.254: U17.24 25.96,55.07 v26.67,54.36 | v23.37,40.13 21.59,40.13 21.41,40.33 R62.1 19.23,40.18 19.05,39.5 19.05,38.84 U15.22
  Bottom 0.254: v26.67,54.36 27.18,53.85 27.18,43.94 v23.37,40.13
LED_-FAULT
  Top 0.254: R44.1 26.5,49.25 R46.1 28.25,49.22 29.21,48.26 29.21,38.35 30.73,36.83 54.98,36.83 61.69,43.43 79.5,43.43 83.06,46.99 85.09,46.99 86.36,45.72 X1.28
LED_-FAULT_IN
  Top 0.254: U17.23 25.46,54.3 26.42,53.34 26.42,52.81 R44.2
LED_OFF
  Bottom 0.254: X1.23 82.94,50.81 81.88,49.75 80.76,49.75 R29.1
LED_OFF_OUT  (via drill 0.3)
  Top 0.254: U17.39 41.94,61.56 42.06,61.56 42.5,61.12 42.5,57.5 46.25,53.75 47.75,52.25 v53.88,52.25
  Bottom 0.254: v53.88,52.25 55.5,52.25 55.62,52.25 56,51.88 56,47.38 57.88,45.5 72.75,45.5 74.5,47.25 74.5,49.62 74.64,49.76 R29.2
LED_SCL
  Top 0.254: U14.9 83.62,38.22 X1.33
LED_SDA
  Top 0.254: U14.8 81.73,37.56 X1.35
MUX_A0  (via drill 0.38)
  Top 0.254: v53.34,61.45 53.34,61.2 53.85,60.69 54.91,60.69 U2.1 | 54,68.58 53.59,68.58 52.58,67.56 50.04,67.56 49.53,68.07 36.3,68.07 R73.2 | 54,68.58 54.84,68.58 U5.1 | v53.85,66.28 53.85,68.43 54,68.58
  Bottom 0.254: v53.85,66.28 53.85,65.77 53.34,65.26 v53.34,61.45
MUX_A1  (via drill 0.38)
  Top 0.254: U2.16 50.78,60.67 51.82,61.71 51.82,64.5 v50.8,65.77 | v50.55,68.33 50.42,68.33 50.04,68.71 49.06,68.71 U5.16 42.37,68.72 42.27,68.72 41.25,68.75 40.25,69.75 33.12,69.75 32.88,69.5 R72.2
  Bottom 0.254: v50.8,65.77 50.8,68.07 v50.55,68.33
MUX_A2  (via drill 0.38)
  Top 0.254: U2.15 50.41,61.32 51.31,62.21 51.31,63.48 v50.8,63.99 | v51.31,69.34 49.08,69.34 U5.15 42.48,69.38 41.5,70.36 29.72,70.36 28.96,69.6 U17.51
  Bottom 0.254: v50.8,63.99 51.56,64.5 51.56,69.09 v51.31,69.34
N$1
  Top 0.254: U17.12 18.65,60.56 17.02,58.93 8.64,58.93 8.13,59.44 8.13,60.71 8.03,60.81 U18.1
N$2
  Top 0.254: R17.1 R16.2 71.75,73.15 71.63,73.03 66.52,73.03 66.01,72.52 62.48,72.52 62.1,72.9 62.1,73.84 U6.3
N$3
  Top 0.254: U5.7 55.01,72.64 58.17,72.64 58.67,73.15 58.67,74.68 59.44,75.44 62.48,75.44 62.85,75.07 U6.2 U6.1
N$4
  Top 0.254: R47.2 55,88.38 | 55,88.38 R45.1 | TR1.1 55.02,88.35 55,88.38
N$5
  Top 0.254: C32.1 14.79,63.38 Q1.1 17.09,62.56 U17.8
N$6
  Top 0.254: C31.1 14.79,60.88 Q1.2 16.27,60.95 16.26,60.96 17.23,62.06 U17.9
N$7
  Top 0.254: U7.15 52.62,20.26 R19.2
N$8
  Top 0.254: U5.6 55.02,72.01 58.93,72.01 59.6,72.68 U6.7 U6.6
N$9
  Top 0.254: U5.5 55.03,71.37 58.93,71.37 59.6,70.7 U6.8 U6.9
N$10
  Top 0.254: U20.5 68.52,84.57 68.45,84.5 68.59,84.5 68.5,84.41 R74.2
N$11
  Top 0.254: U5.4 55.05,70.61 58.42,70.61 58.67,70.36 58.67,67.56 59.44,66.8 62.48,66.8 62.85,67.17 U6.13 U6.14
N$12
  Top 0.254: U3.1 U3.2 63,64.93 63,65.75 62.62,66.12 59.25,66.12 59,65.88 59,65 58.57,64.57 U2.7
N$13  (via drill 0.38)
  Top 0.254: U17.7 23.05,63.06 v23.11,62.99
  Bottom 0.254: v23.11,62.99 25.15,62.99 25.03,62.88 C33.1
N$14
  Bottom 0.254: U13.1 48.91,80.08 48,81 43,81 R39.2
N$15
  Top 0.254: U7.16 51.35,20.14 R21.2
N$16  (via drill 0.38)
  Top 0.254: U14.15 U14.16 U14.17 U14.18 U14.19 | U14.19 U14.20 | v67.25,35.88 67.62,36.25 67.64,36.27 U14.19
  Bottom 0.254: R54.1 67,35.62 v67.25,35.88
N$17  (via drill 0.38)
  Top 0.254: U17.57 25.96,71.96 v31,77 | v31,80 30,81 30,83.12 29.62,83.5 29.5,83.62 26.88,83.62 26.62,83.88 26.62,88.12 X6.7
  Bottom 0.254: v31,77 v31,80
N$18  (via drill 0.38)
  Top 0.254: U17.56 26.46,71.46 v32,77 | v32,80 32,82.5 35.38,85.88 35.38,86.88 34.5,87.75 31.75,87.75 31.25,88.25 31.25,91.4 X6.5
  Bottom 0.254: v32,77 v32,80
N$19  (via drill 0.38)
  Top 0.254: U17.55 26.96,70.96 v33,77 | v33,80 33,82.62 36,85.62 36,87 34.62,88.38 33,88.38 32.38,89 32.38,91.33 X6.3
  Bottom 0.254: v33,77 v33,80
N$20  (via drill 0.38)
  Top 0.254: U17.54 27.46,70.46 v34,77 | v34,80 34,82.62 36.75,85.38 36.75,87.12 34.75,89.12 34.25,89.12 33.75,89.62 X6.1
  Bottom 0.254: v34,77 v34,80
N$21
  Top 0.254: U3.6 U3.7 58.74,63.92 U2.6
N$22
  Bottom 0.254: U13.4 43.07,78.68 R36.2
N$23
  Top 0.254: X6.10 28.67,84.61 28.7,84.58 28.46,84.34 | R71.1 28.46,84.34 | 28.46,84.34 28.45,84.33
N$24
  Top 0.254: R15.1 R14.2 71.75,71.11 71.63,70.99 67.31,70.99 66.8,71.5 66.3,72 64,72 64.25,72 64.26,72.01 62.36,72.01 61.98,71.63 61.09,71.63 60.58,72.14 60.58,72.64 60.96,73.03 60.96,73.88 U6.5
N$25
  Top 0.254: R13.1 R12.2 71.75,69.21 71.63,69.09 67.56,69.09 65.79,70.87 60.96,70.87 60.45,70.36 60.45,69.6 60.96,69.09 60.96,68.2 U6.10
N$26
  Top 0.254: R11.1 R10.2 71.75,67.43 71.37,67.06 67.31,67.06 66.8,67.56 65.8,68.58 65.04,69.34 62.48,69.34 62.23,69.09 62.23,68.17 U6.12
N$27
  Top 0.254: R18.2 46.09,73.27 46.99,74.42 52.07,74.42 53.09,73.15 54.86,73.15 U5.8
N$28
  Top 0.254: U3.9 U3.8 59.74,62.26 59,63 58.73,63.27 U2.5
N$29
  Top 0.254: R9.2 51.51,66.86 52.75,65.62 53.16,65.22 U2.8
N$30
  Top 0.254: U3.14 U3.13 62.99,58.01 63,58 62.62,57.62 59.5,57.62 59,58.12 59,62 58.38,62.62 U2.4
N$31
  Top 0.254: U2.12 48.27,63.27 47,62 47,60 48,59 57,59 59,57 62,57 62.62,57 63,56.62 63.05,56.58 U1.2 U1.1
N$32
  Top 0.254: U17.13 18.91,60.06 17.78,58.93 17.78,57.66 17.27,57.15 15.48,57.15 15.2,57.43 R68.2
N$33
  Top 0.61: U10.1 41.52,50.08 41.15,50.07 39.88,50.07 39.92,50.11 C23.1
N$34
  Top 0.254: U8.5 41.42,18.06 R24.2
N$35
  Top 0.254: U8.6 40.16,18.27 40.13,18.29 40.09,18.25 R25.2
N$36
  Top 0.254: U11.5 49.05,18.02 R30.2
N$37  (via drill 0.3)
  Top 0.254: U17.43 43.56,63.56 44.5,62.62 44.5,59 47.12,56.38 48.75,54.75 v57,54.75
  Bottom 0.254: v57,54.75 57.12,54.62 57.38,54.62 58.12,53.88 58.12,48.38 59,47.5 71.5,47.5 72.5,48.5 72.5,54.12 73.68,55.3 R70.2
N$38  (via drill 0.3)
  Top 0.254: U17.42 43.19,63.06 44,62.25 44,58.62 46.88,55.75 48.5,54.12 v56.25,54.12
  Bottom 0.254: v56.25,54.12 56.88,54.12 57.12,54.12 57.62,53.62 57.62,48.12 58.75,47 71.75,47 73,48.25 73,53.5 73.44,53.94 R69.2
N$39
  Top 0.254: U11.6 47.77,18.13 R31.2
N$40
  Top 0.406: U12.6 30.49,16.24 R38.2
N$41
  Top 0.254: R41.2 29,16.97 29.21,16.76 29.21,13.72 29.97,12.95 30.23,12.95 30.48,12.7 30.48,11.68 30.49,11.67 U12.1
N$42  (via drill 0.31)
  Top 0.2: v26,60 26,59 26.46,58.54 U17.25
  Bottom 0.2: R66.2 25,65 26,64 v26,60
N$43  (via drill 0.4)
  Top 0.406: 55.42,91 55,91 54.77,91 54.72,91.05
  Top 0.61: F1.1 55.15,91.72 | 55.15,91.72 v55,91.88 | 55.15,91.72 55.15,91.15 55,91
  Top 0.635: X2.1 43.25,91.26 44.57,92.58 52.97,92.58 54.61,90.93 54.72,91.05
  Bottom 0.61: v55,91.88 C27.1
N$44
  Top 0.254: U2.10 47.82,64.57 45.62,62.38 45.62,59.62 47.5,57.75 56.25,57.75 59,55 59,49.9 U1.8 U1.9
N$45
  Top 0.254: U2.9 47.47,65.22 45,62.75 45,59.38 47.25,57.12 55.75,57.12 58.38,54.5 58.38,48.75 59.5,47.62 62.75,47.62 63.12,48 63.12,49.02 U1.13 U1.14
N$46
  Top 0.61: U10.14 53.61,46.91 C22.1
N$47
  Top 0.254: R1.1 C1.1 71.75,49 71.5,48.75 67.38,48.75 65.62,50.5 62.75,50.5 62.5,50.25 62.4,50.15 U1.12
N$48
  Top 0.254: R2.1 C2.1 71.75,51.5 71.5,51.25 66.75,51.25 66,51.88 61.5,51.88 61.12,51.5 61.1,51.4 U1.10
N$49
  Top 0.254: U15.6 17.08,47.3 17.78,48.01 17.78,51.04 R53.1
N$50
  Top 0.254: U15.7 16.43,51.39 16,51.82 16,53.17 R52.1
N$51
  Top 0.254: U3.3 62.36,64.91 62.36,63.75 62.61,63.5 67.01,63.5 67.52,64.01 71.63,64.01 71.75,64.13 C10.1 R8.1
N$52
  Top 0.254: U3.5 61.09,64.88 61.09,63.75 60.58,63.5 60.58,62.99 61.21,62.36 62.1,62.36 62.48,62.99 64.39,62.99 66.42,62.99 67.06,62.36 67.44,61.98 71.63,61.98 71.75,62.1 C8.1 R7.1
N$53
  Top 0.254: U3.10 60.96,59.2 60.96,60.33 60.71,60.58 60.71,61.47 61.34,61.85 65.79,61.85 67.56,60.07 71.63,60.07 71.75,60.19 C7.1 R6.1
N$54
  Top 0.254: U3.12 62.36,59.14 62.36,60.07 62.61,60.33 65.17,60.33 65.93,59.56 66.93,58.42 67.31,58.04 71.5,58.04 71.75,58.29 C6.1 R5.1
N$55
  Top 0.254: R3.1 C3.1 71.75,56 71.5,55.75 67.38,55.75 65.25,53.62 62.62,53.62 62.5,53.75 62.4,53.85 U1.3
N$56
  Top 0.254: U15.8 15.78,50.52 14.48,51.82 14.48,53.14 R51.1
N$57
  Top 0.254: U15.9 15.13,50.15 13.21,52.07 13.21,53.14 R50.1
N$58
  Top 0.254: R4.1 C5.1 71.75,53.75 71.62,53.62 67.25,53.62 66,52.38 61.5,52.38 60.88,53 60.88,53.62 61.12,53.88 61.12,54.88 U1.5
N$59
  Top 0.61: C41.2 55.42,82.05 R75.1
N$60
  Top 0.254: U17.33 32.01,58.12 X5.1
N$61
  Top 0.254: U17.32 29.96,55.04 31,54 32,54 X4.1
N$62
  Top 0.254: R73.1 34.5,68.5 34.25,68.25 30.1,68.25 U17.49
N$63
  cutout Bottom (isolate 0.305, no thermals): 5,88 5,81 13,81 13,88
  cutout Bottom (isolate 0.305, no thermals): 81,89 81,81 89,81 89,89
  cutout Bottom (isolate 0.305, no thermals): 81,13 81,6 89,6 89,13
  cutout Bottom (isolate 0.305, no thermals): 5,13 5,5 13,5 13,13
N$64
  Top 0.254: U17.50 29.46,69.08 29.88,69.5 31.25,69.5 R72.1
N$65
  Top 0.61: U7.14 53.9,18.77 54.62,19.5 54.62,20.07 BAT1.P
N$70
  Top 0.254: U15.5 17.73,46.94 19.05,48.26 19.05,51.24 R55.1
N$71
  Top 0.254: U15.4 18.38,46.06 20.57,48.26 20.57,51.18 R56.1
N$72
  Top 0.254: U15.3 19.03,45.44 22.1,48.51 22.1,51.31 22.06,51.31 R57.1
N$82
  Top 0.61: U10.8 42.33,39.49 43.18,38.64 45.59,38.64 D1.A
  Top 0.813: 36.32,41.43 38.61,41.43 38.35,41.18 38.35,41.19 L1.P$2
  Top 1.016: U10.8 36.31,40.55 36.32,41.43
N$90
  Top 0.61: C21.2 53.57,40.55 U10.9 51.56,40.45 51.56,39.15 50.62,38.46 D1.C
N$666
  Top 0.61: U20.6 U20.7 66.13,81.03 C39.1 65.05,79.94 64.11,79.94 C40.1 63.39,79.94 63.07,79.62 U21.3
OBC_-FAULT  (via drill 0.38)
  Top 0.254: U20.8 70.33,79.75 70.33,79.03 71.87,77.49 v77.2,77.49 | v81.03,80.52 87.38,80.52 88.65,79.25 88.65,40.49 X1.34
  Bottom 0.254: v77.2,77.49 80.99,80.49 v81.03,80.52
OBC_I2C_OFF  (via drill 0.38)
  Top 0.254: U9.P$3 43.2,5.55 R27.1 37.75,5.62 36.25,7.12 v36.25,8.75 | U17.30 28.96,58.46 v29.12,58.62
  Bottom 0.254: v29.12,58.62 29.12,55.62 29.62,55.12 29.62,39.88 28.38,38.62 28.38,12.25 31.88,8.75 v36.25,8.75
OBC_OFF
  Top 0.254: U20.3 73.77,82.25 R76.2 C38.1 79,80.77 82.3,77.47 87.63,77.47 88.14,76.96 88.14,50.14 X1.26
OBC_SCL  (via drill 0.38)
  Top 0.254: R41.1 29.04,19.5 39.75,19.5 R25.1 | R25.1 | 47.65,20.65 49,20.62 50.25,22 50.99,22 R21.1 | 47.65,20.65 R31.1 47.62,19.78 v47.62,21.25 | R25.1 40.9,20.65 45,20.65 | 45,20.65 47.65,20.65 | v58.75,35.5 62.5,39.25 62.62,39.38 62.77,39.52 U14.14 | R58.1 44.62,20.28 45,20.65
  Bottom 0.254: v58.75,35.5 58.75,35 58.25,34.5 52.88,34.5 52.12,33.75 52.12,25.75 v47.62,21.25
OBC_SDA  (via drill 0.38)
  Top 0.254: R38.1 31.75,19 41.88,19 | 41.88,19 42,19 43,19 | R24.1 41.88,19.49 41.88,19 | 43,19 46,19 | 46,19 50,19 50.25,19.12 50.25,20 | 50.25,20 50.25,20.62 50.62,21 52.75,21 52.74,21.01 R19.1 | R30.1 49.52,20 50.25,20 | 68.97,40.1 U14.13 69.03,40.1 61.85,40.1 v57.25,35.5 | v46,19.62 46,19 | R61.1 43.17,19.17 43,19
  Bottom 0.254: v57.25,35.5 52.5,35.5 51,34 51,27 46,22 v46,19.62
OBC_WT_RST  (via drill 0.38)
  Top 0.254: C35.1 9.82,64.94 v9.91,65.02 | v14.22,73.03 19.18,73.03 U19.3
  Top 0.305: U18.7 8.68,64.9 C35.1
  Bottom 0.254: v9.91,65.02 10.67,65.02 12.19,66.55 12.19,70.99 v14.22,73.03
PANELTEMP_SCL  (via drill 0.38)
  Top 0.254: X1.29 82.8,42.26 82.8,41.4 80.92,39.52 U14.11 73.26,39.52 v73.15,39.62
  Bottom 0.254: v73.15,39.62 70.88,39.62 R59.1
PANELTEMP_SDA  (via drill 0.38)
  Top 0.254: X1.31 83.81,40.65 83.82,40.64 83.57,40.64 81.79,38.87 U14.10 73.79,38.87 v73.53,38.61
  Bottom 0.254: v73.53,38.61 73.53,37.72 73.41,37.59 72.52,37.59 72.39,37.72 R60.1 72.39,38.35
RESETOBC  (via drill 0.31)
  Top 0.254: 24.64,73.15 24.64,73.23 | 24.64,73.23 R77.1 24.62,73.17 24.64,73.15 | U19.4 24.54,73.05 | 24.54,73.05 24.64,73.15 | R71.2 26.84,82.84 v24,80 | v25,74 25,73.62 24.62,73.25 24.5,73.12 24.52,73.23 24.64,73.23 | U17.58 25.46,72.13 24.54,73.05
  Bottom 0.254: v24,80 24,77 25,76 v25,74
RTC_-INT  (via drill 0.38)
  Top 0.254: 26.92,58.67 26.92,56.55 U17.26 26.96,58.96 v27.18,59.18 | v55.51,5.75 55.38,5.75
  Top 0.305: 55.38,5.75 54.46,5.75 R20.1
  Top 0.61: U7.3 53.9,6.49 R20.1
  Bottom 0.254: v27.18,59.18 27.18,56.39 28.7,54.86 28.7,40.39 27.43,39.12 27.43,12.19 31.75,7.87 51.82,7.87 53.08,6.48 55.14,6.48 v55.51,5.75
RXD1  (via drill 0.38)
  Top 0.254: U17.35 33.44,59.56 34,59 34.88,59 v35.38,59.5
  Bottom 0.254: v35.38,59.5 35.38,73.25 40,77.88 40,80.25 40.62,80.88 41.12,80.88 R39.1
SC_-ON  (via drill 0.38)
  Top 0.254: U15.19 17.08,32.96 22.86,27.18 57.91,27.18 59.69,25.4 v74.79,25.4
  Bottom 0.254: v74.79,25.4 79.25,25.4 83.06,29.21 84.99,29.21 X1.40
SC_-ON_IN
  Top 0.254: R55.2 19.06,53.61 20.57,55.12 22.73,55.12 22.99,55.37 22.99,56.48 U17.18
SC_-PFO  (via drill 0.38)
  Top 0.254: U15.16 15.13,31.36 21.59,24.89 56.9,24.89 57.11,24.89 62,20 70,20 v73,17 | v77,17 79,19 85,19 86,20 86,20.06 X1.48
  Bottom 0.254: v73,17 75,17 v77,17
SC_-PFO_IN
  Top 0.254: U17.15 19.44,59.06 19.05,58.67 19.05,57.15 17.78,55.88 15.24,55.88 14.73,55.37 14.73,54.89 R51.2
SCCHG_EN
  Bottom 0.254: X1.21 82.47,53.35 81.62,52.5 80.77,52.5 R23.1
SCCHG_EN_OUT  (via drill 0.3)
  Top 0.254: U17.41 42.81,62.56 43.5,61.88 43.5,58.25 46.62,55.12 48.25,53.5 v55.5,53.5
  Bottom 0.254: v55.5,53.5 56.75,53.5 57.12,53.12 57.12,48 57.12,47.75 58.38,46.5 72.12,46.5 73.5,47.88 73.5,51.88 74.15,52.52 R23.2
SCOUT_-PG  (via drill 0.38)
  Top 0.254: U15.15 14.48,30.99 21.34,24.13 56.64,24.13 61.77,19 69,19 v72,16 | v76,16 82.38,16 82.75,16.38 85.38,16.38 86.25,17.25 86.25,17.75 86.27,17.77 X1.50
  Bottom 0.254: v72,16 75,16 v76,16
SCOUT_-PG_IN
  Top 0.254: U17.14 19.17,59.56 18.29,58.67 18.29,57.4 17.27,56.39 13.72,56.39 12.95,55.63 12.95,54.89 R50.2
SCOUT_EN
  Bottom 0.254: X1.22 85.85,53.35 84.75,52.25 83,52.25 81.88,51.12 80.77,51.12 R22.1
SCOUT_EN_OUT  (via drill 0.3)
  Top 0.254: U17.40 42.44,62.06 43,61.5 43,57.88 46.38,54.5 48,52.88 v54.75,52.88
  Bottom 0.254: v54.75,52.88 56.25,52.88 56.62,52.5 56.62,47.5 58.12,46 72.38,46 74,47.62 74,50.75 74.39,51.14 R22.2
SOLAR_-ON  (via drill 0.38)
  Top 0.254: U15.21 18.38,34.2 23.62,28.96 67.42,28.96 68.94,27.43 v69.47,27.43
  Bottom 0.254: v69.47,27.43 75.95,27.43 82.8,34.29 84.99,34.29 X1.36
SOLAR_-ON_IN
  Top 0.254: U17.20 23.96,54.95 23.11,54.1 22.35,54.1 22.1,53.85 22.1,52.85 R57.2
SOLAR_CS1
  Top 0.254: R8.2 75.16,65 75.06,64.77 75.06,62.23 75.18,61.98 81.03,61.98 82.04,60.96 X1.15
SOLAR_CS2
  Top 0.254: R7.2 81.53,63 82.3,62.23 84.99,62.23 X1.14
SOLAR_CS3
  Top 0.254: R6.2 80.48,61 83.06,58.42 X1.17 | 83.82,58.42 X1.17 | X1.17
SOLAR_CS4  (via drill 0.38)
  Top 0.254: R5.2 80.7,59 v80.77,58.93
  Bottom 0.254: v80.77,58.93 82.04,58.93 82.8,59.69 84.99,59.69 X1.16
SOLAR_CS5
  Top 0.254: 82.65,57 R3.2 82.65,57 | 82.65,57 82.8,57.15 84.99,57.15 X1.18
STATUS_LED  (via drill 0.38)
  Top 0.254: R68.1 13.62,57.52 13.62,58.38 v6.38,58.38 | v3.75,59.12 3.75,68.75 15,80 22,80 26,84 v26,90
  Top 0.406: R68.1 12.38,57.52 LED1.A
  Bottom 0.254: v6.38,58.38 4.62,58.38 v3.75,59.12 | v26,90 27,90 34,90 36,90 36.25,90.25 JP1.2
SUN_IN
  Top 0.254: U2.11 48.05,63.92 46.25,62.12 46.25,59.88 47.75,58.38 56.75,58.38 59.75,55.38 59.75,54.95 U1.7 U1.6
SUPERCAP_TEMP  (via drill 0.38)
  Top 0.254: R1.2 75.75,47.75 74,46 62.25,46 v56.5,40.5 | v64,21 71,21 v74,18
  Bottom 0.254: v64,21 59,26 59,33 61,35 61,35.88 v56.5,40.5 | v74,18 83.52,18 X1.49
TEMP_-ALERT  (via drill 0.38)
  Top 0.254: U17.27 27.43,56.48 27.43,54.48 27.81,54.1 27.81,50.93 29.72,49.02 29.72,39.37 v30.23,38.86 | v33.27,10.16 34.04,10.92 34.04,12.21 R33.2 33.94,12.19 33.02,12.19 32.47,11.64 U12.3
  Bottom 0.254: v30.23,38.86 30.23,11.68 32,9.91 33.02,9.91 v33.27,10.16
TXD1  (via drill 0.38)
  Top 0.254: U17.34 33.06,59.06 34.12,58 v35,58
  Bottom 0.254: v35,58 36.12,59.25 36.12,72.88 41.25,78 R36.1
VBAT
  Top 0.254: R13.2 79.8,69.98 X1.11
  Top 0.61: X1.11 X1.12
VBUS  (via drill 0.38)
  Top 0.254: R15.2 78.33,71.98 79.38,73.03 | U15.23 U15.24 20.33,33.39 24,29.59 67.82,29.59 v68.71,28.7
  Top 0.406: U20.2 U20.1 77.22,79.75 78.74,78.23 78.74,73.66 79.38,73.03 81.28,71.12 X1.7 | X1.7 | X1.7 X1.8 | X1.8 | X1.8 X1.10 X1.9
  Bottom 0.254: v68.71,28.7 74.93,28.7 83.06,36.83 86.87,36.83 87.88,37.85 87.88,66.98 X1.10
  pour Top (no thermals): 72.63,81.3 72.63,79.52 77.2,79.52 78.74,77.98 78.74,72.64 83.31,68.07 87.12,68.07 87.12,71.37 86.87,71.63 82.55,71.63 80.52,73.66 80.52,77.98 77.2,81.3
VEXT  (via drill 0.4)
  Top 0.254: 58,90 58,89.12 R47.1
  Top 0.61: U16.P$1 60,90.99 | 60,90.99 58.99,90.99 58,90 58.35,90.35 F1.2 | v60,91.88 60,90.99
  Bottom 0.61: C30.P$1 v60,91.88
VEXT_OFF  (via drill 0.38)
  Top 0.254: R49.1 60.53,87.97 60.96,88.39 | 60.96,88.39 60.96,89.01 U16.P$3 | U17.36 33.88,60.06 34.12,60 v34.44,59.81 34.62,59.75 | v45,87 v49,87 | v62,87 62,87.35 60.96,88.39
  Bottom 0.254: v34.44,59.81 34.44,73.44 39,78 39,80 39,81 40,82 43,82 44,83 44,84 44,86 v45,87 | v49,87 57,87 58,88 61,88 v62,87
VREF_EXT  (via drill 0.38)
  Top 0.254: U17.10 21.68,61.56 v22.1,61.98 | v14.99,67.31 14.99,68.81 C13.2 U4.4
  Bottom 0.254: v22.1,61.98 22.1,63.25 21.84,63.5 18.8,63.5 v14.99,67.31
VSOLAR  (via drill 0.38, 0.6)
  Top 0.254: R17.2 76.38,73.98 v76.96,73.91
  Top 0.61: v65.79,78.52 65.79,78.21 68,76 75,76 77,74 75.77,74 R17.2
  Top 0.635: U16.P$5 65.22,90.99 v65.28,90.93
  Bottom 0.61: C29.P$1 65,91 65,90.93 v65.28,90.93
  Bottom 0.635: v65.28,90.93 65.28,88.39 65.79,87.88 v65.79,78.52 | v76.96,73.91 83.57,73.91 83.82,73.66 X1.6 X1.5
VSUPERCAP
  Top 0.254: R11.2 79.26,67.98 X1.13

## Text on the board
Document: A | B | LED | GND | SDA | SCL | GND